# Altium schematic sheet StepperMotorDriver_Ver_0.1.SchDoc
size A3
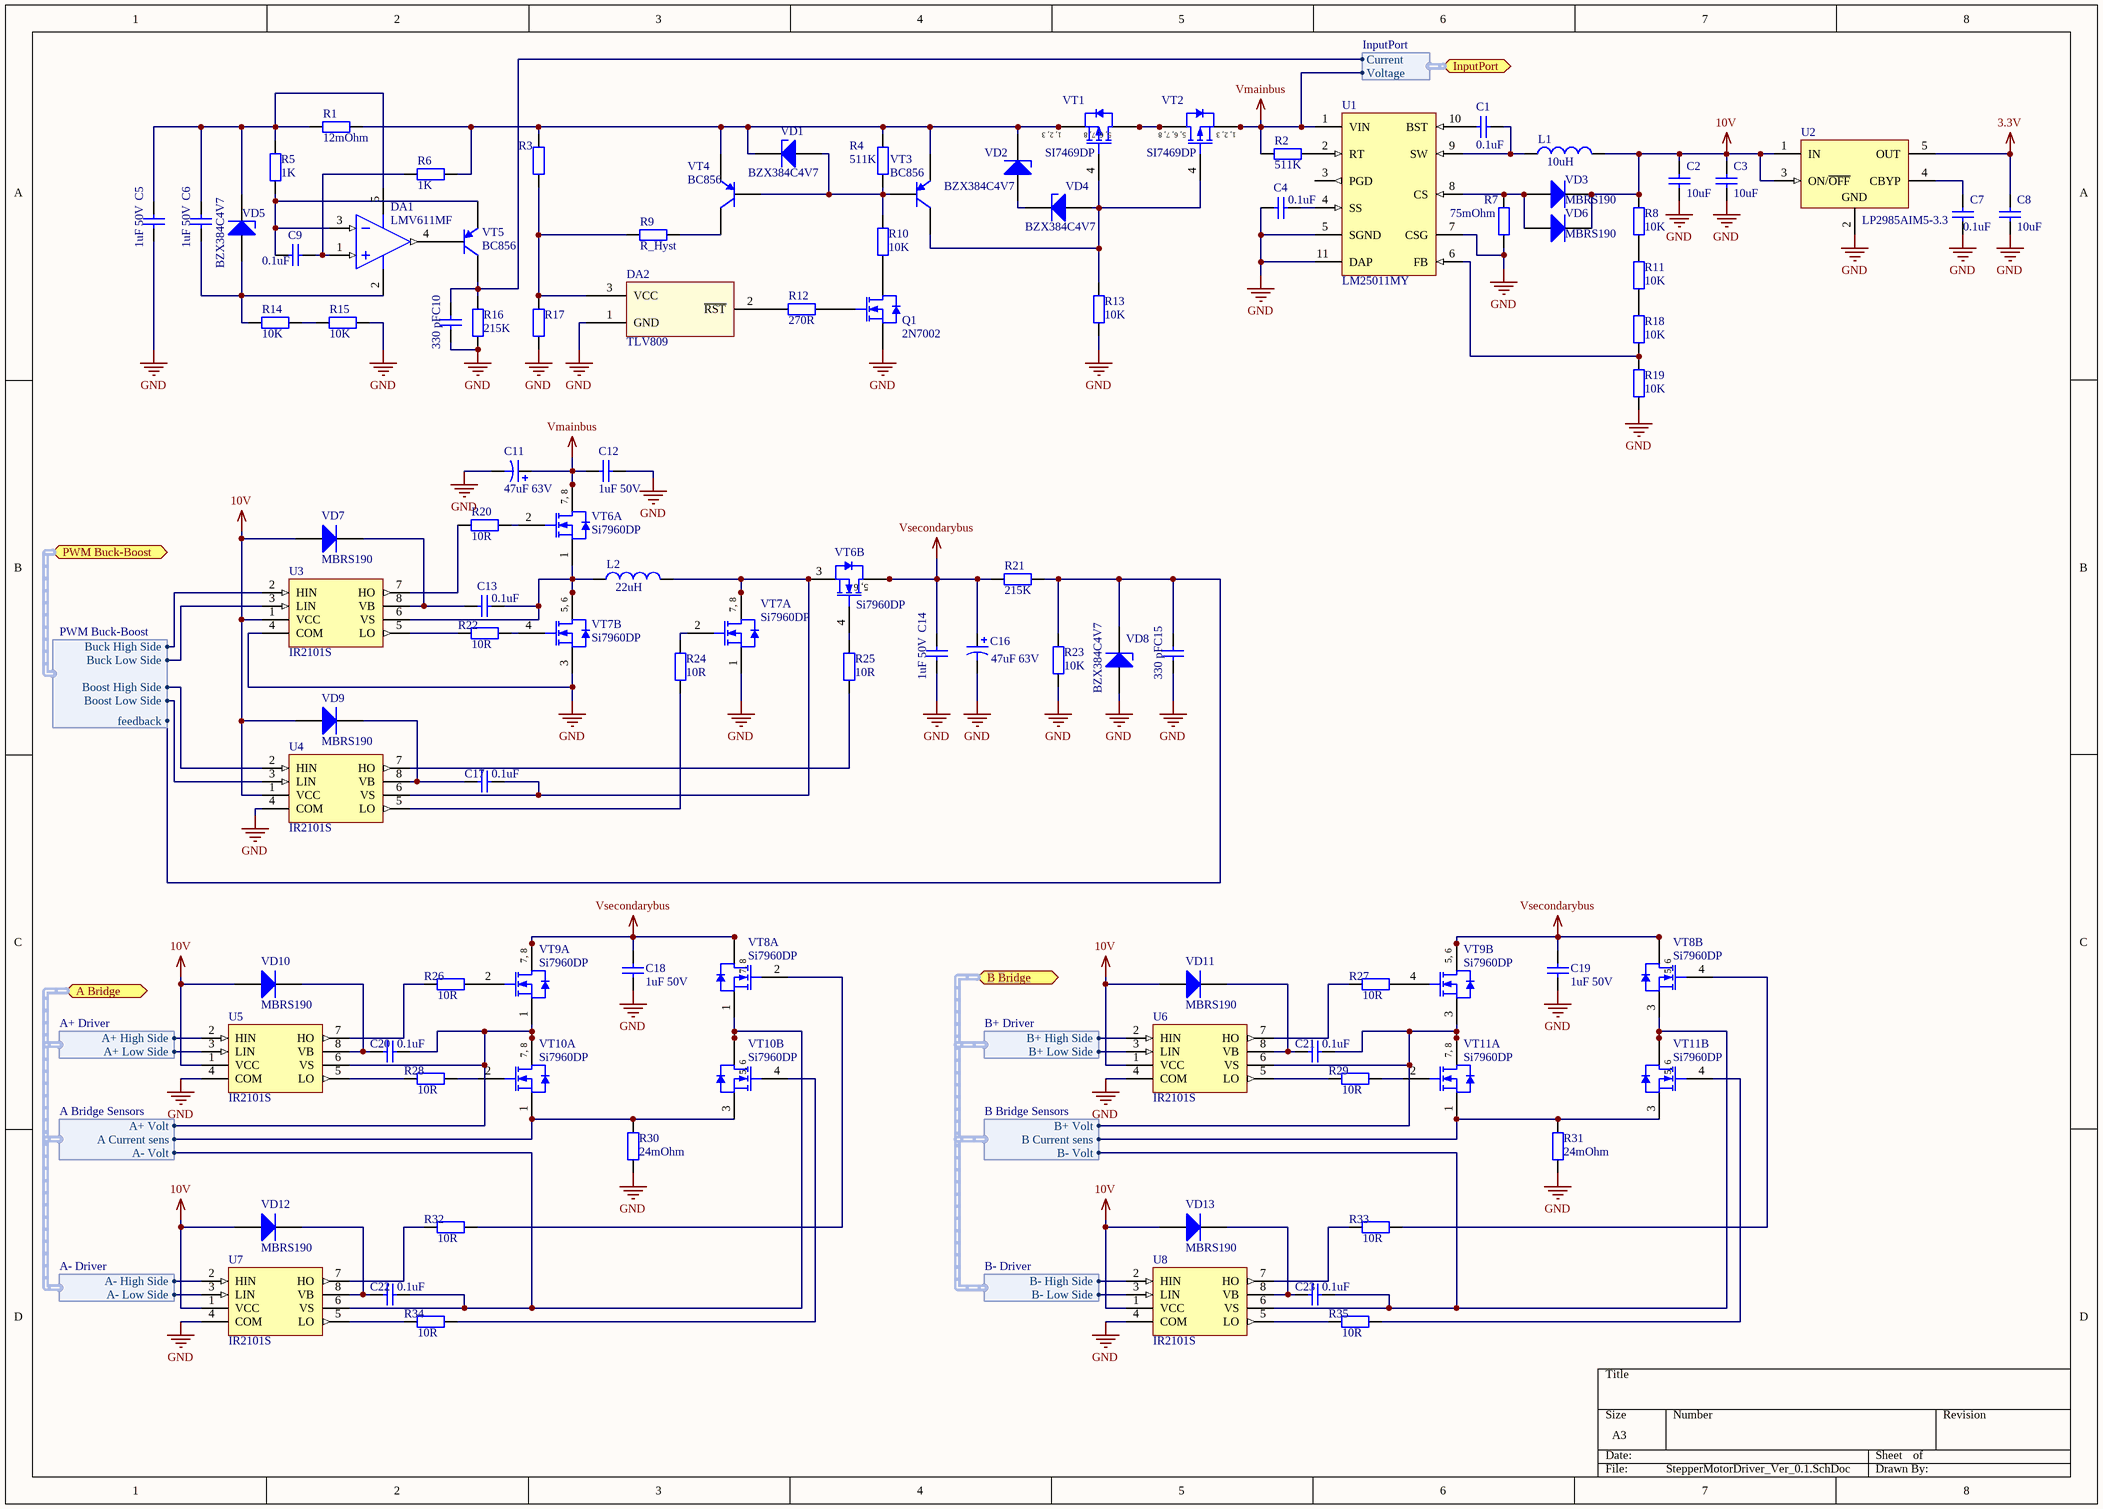
[diagram p0: StepperMotorDriver_Ver_0.1.SchDoc]

## Parts
C1  value 0.1uF  [1608[0603]]  (hidden comment: Capacitor)
C2  value 10uF  [C1206]  (hidden comment: Capacitor)
C3  value 10uF  [C1206]  (hidden comment: Capacitor)
C4  value 0.1uF  [1608[0603]]  (hidden comment: Capacitor)
C5  value 1uF 50V  [C0805]  (hidden comment: Capacitor)
C6  value 1uF 50V  [C0805]  (hidden comment: Capacitor)
C7  value 0.1uF  [1608[0603]]  (hidden comment: Capacitor)
C8  value 10uF  [C1206]  (hidden comment: Capacitor)
C9  value 0.1uF  [1608[0603]]  (hidden comment: Capacitor)
C10  value 330 pF  [1608[0603]]  (hidden comment: Capacitor)
C11  47uF 63V  [10x10.5]
C12  value 1uF 50V  [C0805]  (hidden comment: Capacitor)
C13  value 0.1uF  [1608[0603]]  (hidden comment: Capacitor)
C14  value 1uF 50V  [C0805]  (hidden comment: Capacitor)
C15  value 330 pF  [1608[0603]]  (hidden comment: Capacitor)
C16  47uF 63V  [10x10.5]
C17  value 0.1uF  [1608[0603]]  (hidden comment: Capacitor)
C18  value 1uF 50V  [C0805]  (hidden comment: Capacitor)
C19  value 1uF 50V  [C0805]  (hidden comment: Capacitor)
C20  value 0.1uF  [1608[0603]]  (hidden comment: Capacitor)
C21  value 0.1uF  [1608[0603]]  (hidden comment: Capacitor)
C22  value 0.1uF  [1608[0603]]  (hidden comment: Capacitor)
C23  value 0.1uF  [1608[0603]]  (hidden comment: Capacitor)
DA1  LMV611MF  [MF05A_M]
DA2  TLV809  [SOT23]
L1  value 10uH  [0402-A]  (hidden comment: Inductor)
L2  value 22uH  [0402-A]  (hidden comment: Inductor)
Q1  2N7002  [SOT23_N]
R1  value 12mOhm  [Res12mOhm]  (hidden comment: Resistor)
R2  value 511K  [J1-0603]  (hidden comment: Resistor)
R3  Resistor  [J1-0603]  (value not drawn)
R4  value 511K  [J1-0603]  (hidden comment: Resistor)
R5  value 1K  [J1-0603]  (hidden comment: Resistor)
R6  value 1K  [J1-0603]  (hidden comment: Resistor)
R7  value 75mOhm  [J1-0603]  (hidden comment: Resistor)
R8  value 10K  [J1-0603]  (hidden comment: Resistor)
R9  value R_Hyst  [J1-0603]  (hidden comment: Resistor)
R10  value 10K  [J1-0603]  (hidden comment: Resistor)
R11  value 10K  [J1-0603]  (hidden comment: Resistor)
R12  value 270R  [J1-0603]  (hidden comment: Resistor)
R13  value 10K  [J1-0603]  (hidden comment: Resistor)
R14  value 10K  [J1-0603]  (hidden comment: Resistor)
R15  value 10K  [J1-0603]  (hidden comment: Resistor)
R16  value 215K  [J1-0603]  (hidden comment: Resistor)
R17  Resistor  [J1-0603]  (value not drawn)
R18  value 10K  [J1-0603]  (hidden comment: Resistor)
R19  value 10K  [J1-0603]  (hidden comment: Resistor)
R20  value 10R  [J1-0603]  (hidden comment: Resistor)
R21  value 215K  [J1-0603]  (hidden comment: Resistor)
R22  value 10R  [J1-0603]  (hidden comment: Resistor)
R23  value 10K  [J1-0603]  (hidden comment: Resistor)
R24  value 10R  [J1-0603]  (hidden comment: Resistor)
R25  value 10R  [J1-0603]  (hidden comment: Resistor)
R26  value 10R  [J1-0603]  (hidden comment: Resistor)
R27  value 10R  [J1-0603]  (hidden comment: Resistor)
R28  value 10R  [J1-0603]  (hidden comment: Resistor)
R29  value 10R  [J1-0603]  (hidden comment: Resistor)
R30  value 24mOhm  [Res24mOhm]  (hidden comment: Resistor)
R31  value 24mOhm  [Res24mOhm]  (hidden comment: Resistor)
R32  value 10R  [J1-0603]  (hidden comment: Resistor)
R33  value 10R  [J1-0603]  (hidden comment: Resistor)
R34  value 10R  [J1-0603]  (hidden comment: Resistor)
R35  value 10R  [J1-0603]  (hidden comment: Resistor)
U1  LM25011MY  [MUC10A_N]
U2  LP2985AIM5-3.3  [MF05A_N]
U3  IR2101S  [SO-8_N]
U4  IR2101S  [SO-8_N]
U5  IR2101S  [SO-8_N]
U6  IR2101S  [SO-8_N]
U7  IR2101S  [SO-8_N]
U8  IR2101S  [SO-8_N]
VD1  BZX384C4V7  [SOD323]
VD2  BZX384C4V7  [SOD323]
VD3  MBRS190  [DIOM4336X24N]
VD4  BZX384C4V7  [SOD323]
VD5  BZX384C4V7  [SOD323]
VD6  MBRS190  [DIOM4336X24N]
VD7  MBRS190  [DIOM4336X24N]
VD8  BZX384C4V7  [SOD323]
VD9  MBRS190  [DIOM4336X24N]
VD10  MBRS190  [DIOM4336X24N]
VD11  MBRS190  [DIOM4336X24N]
VD12  MBRS190  [DIOM4336X24N]
VD13  MBRS190  [DIOM4336X24N]
VT1  SI7469DP  [PowerPak_SO-8]
VT2  SI7469DP  [PowerPak_SO-8]
VT3  BC856  [SOT23_N]
VT4  BC856  [SOT23_N]
VT5  BC856  [SOT23_N]
VT6  Si7960DP  [PowerPak_SO-8]  (parts A,B of 2)
VT7  Si7960DP  [PowerPak_SO-8]  (parts A,B of 2)
VT8  Si7960DP  [PowerPak_SO-8]  (parts A,B of 2)
VT9  Si7960DP  [PowerPak_SO-8]  (parts A,B of 2)
VT10  Si7960DP  [PowerPak_SO-8]  (parts A,B of 2)
VT11  Si7960DP  [PowerPak_SO-8]  (parts A,B of 2)

## Ports
A Bridge (harness A Bridge Sensors), B Bridge (harness B Bridge Sensors), InputPort (harness InputPort), PWM Buck-Boost (harness PWM Buck-Boost)

## Harnesses
PWM Buck-Boost: Buck High Side, Buck Low Side, Boost High Side, Boost Low Side, feedback
A+ Driver: A+ High Side, A+ Low Side
A- Driver: A- High Side, A- Low Side
A Bridge Sensors: A+ Volt, A- Volt, A Current sens
B+ Driver: B+ High Side, B+ Low Side
B- Driver: B- High Side, B- Low Side
B Bridge Sensors: B+ Volt, B- Volt, B Current sens
InputPort: Voltage, Current

## Nets
3.3V: C8.2 U2.5(OUT)
10V: C2.2 C3.2 L1.2 R8.2 U2.1(IN) U2.3(ON/~{OFF}) U3.1(VCC) U4.1(VCC) U5.1(VCC) U6.1(VCC) U7.1(VCC) U8.1(VCC) VD3.2(K) VD6.2(K) VD7.1(A) VD9.1(A) VD10.1(A) VD11.1(A) VD12.1(A) VD13.1(A)
GND: C2.1 C3.1 C4.1 C5.1 C7.1 C8.1 C10.1 C11.2 C12.1 C14.1 C15.1 C16.2 C18.2 C19.2 DA2.1(GND) Q1.2(S) R7.1 R13.1 R15.2 R16.1 R17.2 R19.1 R23.1 R30.1 R31.1 U1.5(SGND) U1.7(CSG) U1.11(DAP) U2.2(GND) U3.4(COM) U4.4(COM) U5.4(COM) U6.4(COM) U7.4(COM) U8.4(COM) VD8.2(A) VT7.1(S) VT7.3(S)
Vmainbus: C11.1 C12.2 R2.1 U1.1(VIN) VT2.1(S) VT2.2(S) VT2.3(S) VT6.7(D) VT6.8(D) ; port InputPort.Voltage
Vsecondarybus: C14.2 C16.1 C18.1 C19.1 R21.2 VT6.5(D) VT6.6(D) VT8.5(D) VT8.6(D) VT8.7(D) VT8.8(D) VT9.5(D) VT9.6(D) VT9.7(D) VT9.8(D)
NetC1_1: C1.1 L1.1 U1.9(SW)
NetC1_2: C1.2 U1.10(BST)
NetC4_2: C4.2 U1.4(SS)
NetC5_2: C5.2 C6.2 DA1.5(V+) R1.1 R5.2 VD5.1(K)
NetC6_1: C6.1 DA1.2(V-) R14.1 VD5.2(A)
NetC7_2: C7.2 U2.4(CBYP)
NetC9_1: C9.1 DA1.3(IN-) R5.1 VT5.2(E)
NetC9_2: C9.2 DA1.1(IN+) R6.2
NetC10_2: C10.2 R16.2 VT5.3(C) ; port InputPort.Current
NetC13_1: C13.1 U3.8(VB) VD7.2(K)
NetC13_2: C13.2 L2.1 U3.6(VS) VT6.1(S) VT7.5(D) VT7.6(D)
NetC15_2: C15.2 R21.1 R23.2 VD8.1(K) ; port PWM Buck-Boost.feedback
NetC17_1: C17.1 U4.8(VB) VD9.2(K)
NetC17_2: C17.2 L2.2 U4.6(VS) VT6.3(S) VT7.7(D) VT7.8(D)
NetC20_1: C20.1 U5.8(VB) VD10.2(K)
NetC20_2: C20.2 U5.6(VS) VT9.1(S) VT10.7(D) VT10.8(D) ; port A Bridge.A+ Volt
NetC21_1: C21.1 U6.8(VB) VD11.2(K)
NetC21_2: C21.2 U6.6(VS) VT9.3(S) VT11.7(D) VT11.8(D) ; port B Bridge.B+ Volt
NetC22_1: C22.1 U7.8(VB) VD12.2(K)
NetC22_2: C22.2 U7.6(VS) VT8.1(S) VT10.5(D) VT10.6(D) ; port A Bridge.A- Volt
NetC23_1: C23.1 U8.8(VB) VD13.2(K)
NetC23_2: C23.2 U8.6(VS) VT8.3(S) VT11.5(D) VT11.6(D) ; port B Bridge.B- Volt
NetDA1_4: DA1.4(OUT) VT5.1(B)
NetDA2_2: DA2.2(~{RST}) R12.1
NetDA2_3: DA2.3(VCC) R3.2 R9.1 R17.1
NetQ1_1: Q1.1(G) R12.2
NetQ1_3: Q1.3(D) R10.2
NetR1_2: R1.2 R3.1 R4.1 R6.1 VD1.1(K) VD2.1(K) VT1.1(S) VT1.2(S) VT1.3(S) VT3.2(E) VT4.2(E)
NetR2_2: R2.2 U1.2(RT)
NetR4_2: R4.2 R10.1 VD1.2(A) VT3.1(B) VT4.1(B)
NetR7_2: R7.2 U1.8(CS) VD3.1(A) VD6.1(A)
NetR8_1: R8.1 R11.1
NetR9_2: R9.2 VT4.3(C)
NetR11_2: R11.2 R18.2
NetR13_2: R13.2 VD4.2(A) VT1.4(G) VT2.4(G) VT3.3(C)
NetR14_2: R14.2 R15.1
NetR18_1: R18.1 R19.2 U1.6(FB)
NetR20_1: R20.1 U3.7(HO)
NetR20_2: R20.2 VT6.2(G)
NetR22_1: R22.1 U3.5(LO)
NetR22_2: R22.2 VT7.4(G)
NetR24_1: R24.1 U4.5(LO)
NetR24_2: R24.2 VT7.2(G)
NetR25_1: R25.1 U4.7(HO)
NetR25_2: R25.2 VT6.4(G)
NetR26_1: R26.1 U5.7(HO)
NetR26_2: R26.2 VT9.2(G)
NetR27_1: R27.1 U6.7(HO)
NetR27_2: R27.2 VT9.4(G)
NetR28_1: R28.1 U5.5(LO)
NetR28_2: R28.2 VT10.2(G)
NetR29_1: R29.1 U6.5(LO)
NetR29_2: R29.2 VT11.2(G)
NetR30_2: R30.2 VT10.1(S) VT10.3(S) ; port A Bridge.A Current sens
NetR31_2: R31.2 VT11.1(S) VT11.3(S) ; port B Bridge.B Current sens
NetR32_1: R32.1 U7.7(HO)
NetR32_2: R32.2 VT8.2(G)
NetR33_1: R33.1 U8.7(HO)
NetR33_2: R33.2 VT8.4(G)
NetR34_1: R34.1 U7.5(LO)
NetR34_2: R34.2 VT10.4(G)
NetR35_1: R35.1 U8.5(LO)
NetR35_2: R35.2 VT11.4(G)
NetU3_2: U3.2(HIN) ; port PWM Buck-Boost.Buck High Side
NetU3_3: U3.3(LIN) ; port PWM Buck-Boost.Buck Low Side
NetU4_2: U4.2(HIN) ; port PWM Buck-Boost.Boost High Side
NetU4_3: U4.3(LIN) ; port PWM Buck-Boost.Boost Low Side
NetU5_2: U5.2(HIN) ; port A Bridge.A+ High Side
NetU5_3: U5.3(LIN) ; port A Bridge.A+ Low Side
NetU6_2: U6.2(HIN) ; port B Bridge.B+ High Side
NetU6_3: U6.3(LIN) ; port B Bridge.B+ Low Side
NetU7_2: U7.2(HIN) ; port A Bridge.A- High Side
NetU7_3: U7.3(LIN) ; port A Bridge.A- Low Side
NetU8_2: U8.2(HIN) ; port B Bridge.B- High Side
NetU8_3: U8.3(LIN) ; port B Bridge.B- Low Side
NetVD2_2: VD2.2(A) VD4.1(K)
NetVT1_5: VT1.5(D) VT1.6(D) VT1.7(D) VT1.8(D) VT2.5(D) VT2.6(D) VT2.7(D) VT2.8(D)

Not connected (* = marked no-connect by the designer): U1 3(PGD)

## Notes on the sheet
- (in symbol SI7469DP) 5, 6, 7, 8; 1, 2, 3
- (in symbol Si7960DP, part A) 7, 8
- (in symbol Si7960DP, part B) 5, 6

## Library data of the parts
C11 C16 = Cap Pol1: Polarized Capacitor (Radial); Published: 8-Jun-2000; LatestRevisionDate: 17-Jul-2002; LatestRevisionNote: Re-released for DXP Platform.; PackageReference: RB7.6-15; Publisher: Altium Limited; PackageDescription: Polarized Capacitor (Radial); 2 Leads; Value: 47uF 63V
DA1 = LMV611MF: Low Power Single Op Amp, 5-pin SOT-23; PartNumber: LM321MF; Manufacturer: National Semiconductor; PackageTopMarking: A63A*XTT; PowerWise: N; CompType: Amplifiers; Published: 4-Dec-2008; LatestRevisionDate: 13-Jan-2009; LatestRevisionNote: Sim Model Added.; DatasheetVersion: Apr-2001; PackageVersion: revD, Aug-2008; PackageReference: MF05A; Publisher: Altium Limited; PackageDescription: Molded SOT-23, .115 x .063 x .040 in Body, 5 Lead, .0375 in Pitch; Supplier 1: Farnell; Supplier Part Number 1: 9779116RL; Supplier 2: Farnell; Supplier Part Number 2: 9779116; RoHS: N; PinCount: 5; ComponentLink1Description: LM321 Datasheet; ComponentLink1URL: http://www.national.com/ds/LM/LM321.pdf; ComponentLink2Description: LM321 Web Page; ComponentLink2URL: http://www.national.com/pf/LM/LM321.html; ComponentLink3Description: MF05A Package Page; ComponentLink3URL: http://www.national.com/packaging/folders/mf05a.html
DA2 = TLV809: SuperVisor TI
L1 L2 = Inductor: Code_IEC: 1005; Published: 8-Jun-2000; LatestRevisionDate: 29-May-2009; LatestRevisionNote: IPC-7351 Footprint Added.; PackageReference: 0402-A; Publisher: Altium Limited; PackageDescription: Chip Inductor; Code_JEITA: 0402
Q1 = 2N7002: N-channel Enhancement Mode Field-effect Transistor; Published: 17-Sep-2003; LatestRevisionDate: 12-Dec-2006; LatestRevisionNote: IPC-7351 Footprint Added.; DatasheetVersion: 27-Jul-2000; PackageVersion: May-1999; PackageReference: SOT23; Publisher: Altium Limited; PackageDescription: 3-Pin SOT-23 Package 0.95 mm Pitch, 2.3 mm Lead Span; ComponentLink1Description: Manufacturer Link; ComponentLink1URL: http://www.semiconductors.philips.com/; ComponentLink2Description: Datasheet; ComponentLink2URL: http://www.semiconductors.philips.com/acrobat/datasheets/2N7002_4.pdf
U1 = LM25011MY: 42V, 2A Constant On-Time Switching Regulator with Adjustable Current Limit, 10-pin eMSOP; Manufacturer: National Semiconductor; PackageTopMarking: ZXTT*SVUB; PowerWise: N; CompType: Switcher; Published: 9-Oct-2009; LatestRevisionDate: 01-Oct-2010; LatestRevisionNote: Updated datasheet to version Sep-2010.; DatasheetVersion: Sep-2010; PackageVersion: revA, May-2006; PackageReference: MUC10A; Publisher: Altium Limited; PackageDescription: Molded Mini-SO, Exposed Pad .118 x .118 x .034in Body, 10 Lead, .0197in Pitch; PartNumber: LM25011MY; RoHS: Y; PinCount: 10; Code_JEDEC: MO-187-BAT; ComponentLink1Description: LM25011 Datasheet; ComponentLink1URL: http://www.national.com/ds/LM/LM25011.pdf; ComponentLink2Description: LM25011 Web Page; ComponentLink2URL: http://www.national.com/pf/LM/LM25011.html; ComponentLink3Description: MUC10A Package Page; ComponentLink3URL: http://www.national.com/packaging/folders/muc10a.html
U2 = LP2985AIM5-3.3: Micropower 150 mA Low-Noise Ultra Low-Dropout Regulator, 5-pin SOT-23; Manufacturer: National Semiconductor; PackageTopMarking: L0RA*XTT; PowerWise: N; CompType: LDO IC; Published: 4-Dec-2008; DatasheetVersion: Jul-2007; PackageVersion: revD, Aug-2008; PackageReference: MF05A; Publisher: Altium Limited; PackageDescription: Molded SOT-23, .115 x .063 x .040 in Body, 5 Lead, .0375 in Pitch; Supplier 1: Farnell; Supplier Part Number 1: 9778276; Supplier 2: Farnell; Supplier Part Number 2: 9778276RL; PartNumber: LP2985AIM5-3.3; RoHS: N; PinCount: 5; ComponentLink1Description: LP2985 Datasheet; ComponentLink1URL: http://www.national.com/ds/LP/LP2985.pdf; ComponentLink2Description: LP2985 Web Page; ComponentLink2URL: http://www.national.com/pf/LP/LP2985.html; ComponentLink3Description: MF05A Package Page; ComponentLink3URL: http://www.national.com/packaging/folders/mf05a.html
U3-U8 = IR2101S: High and Low Side Driver; Published: 8-Jun-2000; LatestRevisionDate: 13-Apr-2006; LatestRevisionNote: IPC-7351 Footprint Added.; DatasheetVersion: PD60043J; PackageVersion: Feb-2001; PackageReference: SO-8; Publisher: Altium Limited; PackageDescription: 8-Pin Plastic Small Outline Integrated Circuit 1.27 mm Pitch; Code_JEDEC: MS-012-AA; Code_IPC: SOIC127P600-8; ComponentLink1Description: Manufacturer Link; ComponentLink1URL: http://www.irf.com/
VD1 VD2 VD4 VD5 VD8 = BZX384C5V6: Zenner Diode; Published: 17-Sep-2003; LatestRevisionDate: 19-Mar-2004; LatestRevisionNote: Silkscreen size reduced.; DatasheetVersion: 14-Oct-1996; PackageVersion: May-1999; PackageReference: SOD323; Publisher: Altium Limited; PackageDescription: SOD-323/SC-76; 2 Leads; Body 1.7 x 1.3 mm, (LxW); ComponentLink1Description: Manufacturer Link; ComponentLink1URL: http://www.semiconductors.philips.com/; ComponentLink2Description: Datasheet; ComponentLink2URL: http://www.semiconductors.philips.com/acrobat/datasheets/1PS76SB10_2.pdf
VD3 VD6 VD7 VD9-VD13 = MBRS190: Silicon Zener Diode; Published: 8-Jun-2000; LatestRevisionDate: 17-Jul-2002; LatestRevisionNote: Re-released for DXP Platform.; PackageReference: DO-35; Publisher: Altium Limited; ComponentLink1Description: Manufacturer Link; ComponentLink1URL: http://www.vishay.com/
VT1 VT2 = SI7469DP: P-Channel 80V (D-S)  MOSFET; Published: 8-Jun-2000; LatestRevisionDate: 13-Apr-2006; LatestRevisionNote: IPC-7351 Footprint Added.; DatasheetVersion: 17-Dec-1996; PackageVersion: Aug-1998; PackageReference: SO-8; Publisher: Altium Limited; PackageDescription: 8-Pin Small Outline Integrated Circuit 1.27 mm Pitch; ComponentLink1Description: Manufacturer Link; ComponentLink1URL: http://www.vishay.com/
VT3-VT5 = BC856: PNP General-purpose Transistor; Published: 17-Sep-2003; LatestRevisionDate: 12-Dec-2006; LatestRevisionNote: IPC-7351 Footprint Added.; DatasheetVersion: 4-Feb-2002; PackageVersion: May-1999; PackageReference: SOT23; Publisher: Altium Limited; PackageDescription: 3-Pin SOT-23 Package 0.95 mm Pitch, 2.3 mm Lead Span; ComponentLink1Description: Manufacturer Link; ComponentLink1URL: http://www.semiconductors.philips.com/; ComponentLink2Description: Datasheet; ComponentLink2URL: http://www.semiconductors.philips.com/acrobat/datasheets/BC856_BC857_BC858_6.pdf
VT6-VT11 = Si7960DP: Dual N-Channel 60V (D-S), 175'C  MOSFET; Published: 8-Jun-2000; LatestRevisionDate: 13-Apr-2006; LatestRevisionNote: IPC-7351 Footprint Added.; DatasheetVersion: 24-Feb-1998; PackageVersion: Aug-1998; PackageReference: SO-8; Publisher: Altium Limited; PackageDescription: 8-Pin Small Outline Integrated Circuit 1.27 mm Pitch; ComponentLink1Description: Manufacturer Link; ComponentLink1URL: http://www.vishay.com/; ComponentLink2Description: Datasheet; ComponentLink2URL: http://www.vishay.com/docs/70157/70157.pdf
C1-C10 C12-C15 C17-C23 = Capacitor: Published: 8-Jun-2000; LatestRevisionDate: 17-Jul-2002; LatestRevisionNote: Re-released for DXP Platform.; PackageReference: RAD-0.3; Publisher: Altium Limited; PackageDescription: Radial Cap, Thru-Hole; 2 Leads; 0.3 in Pin Spacing
R1-R35 = Resistor: Published: 8-Jun-2000; LatestRevisionDate: 17-Jul-2002; LatestRevisionNote: Re-released for DXP Platform.; PackageReference: AXIAL-0.4; Publisher: Altium Limited; PackageDescription: Axial Device, Thru-Hole; 2 Leads; 0.4 in Pin Spacing